# EasyEDA Pro project ProPrj_buck-boost_2026-01-25.epro

# Schematic Schematic1
Create Date: 2025-06-20; Page Name: P1; Project Name: 双向Buck-Boost; Schematic Name: Schematic1; Update Date: 2025-06-20; Company: 嘉立创EDA; Page Size: A4; Version: V1.0
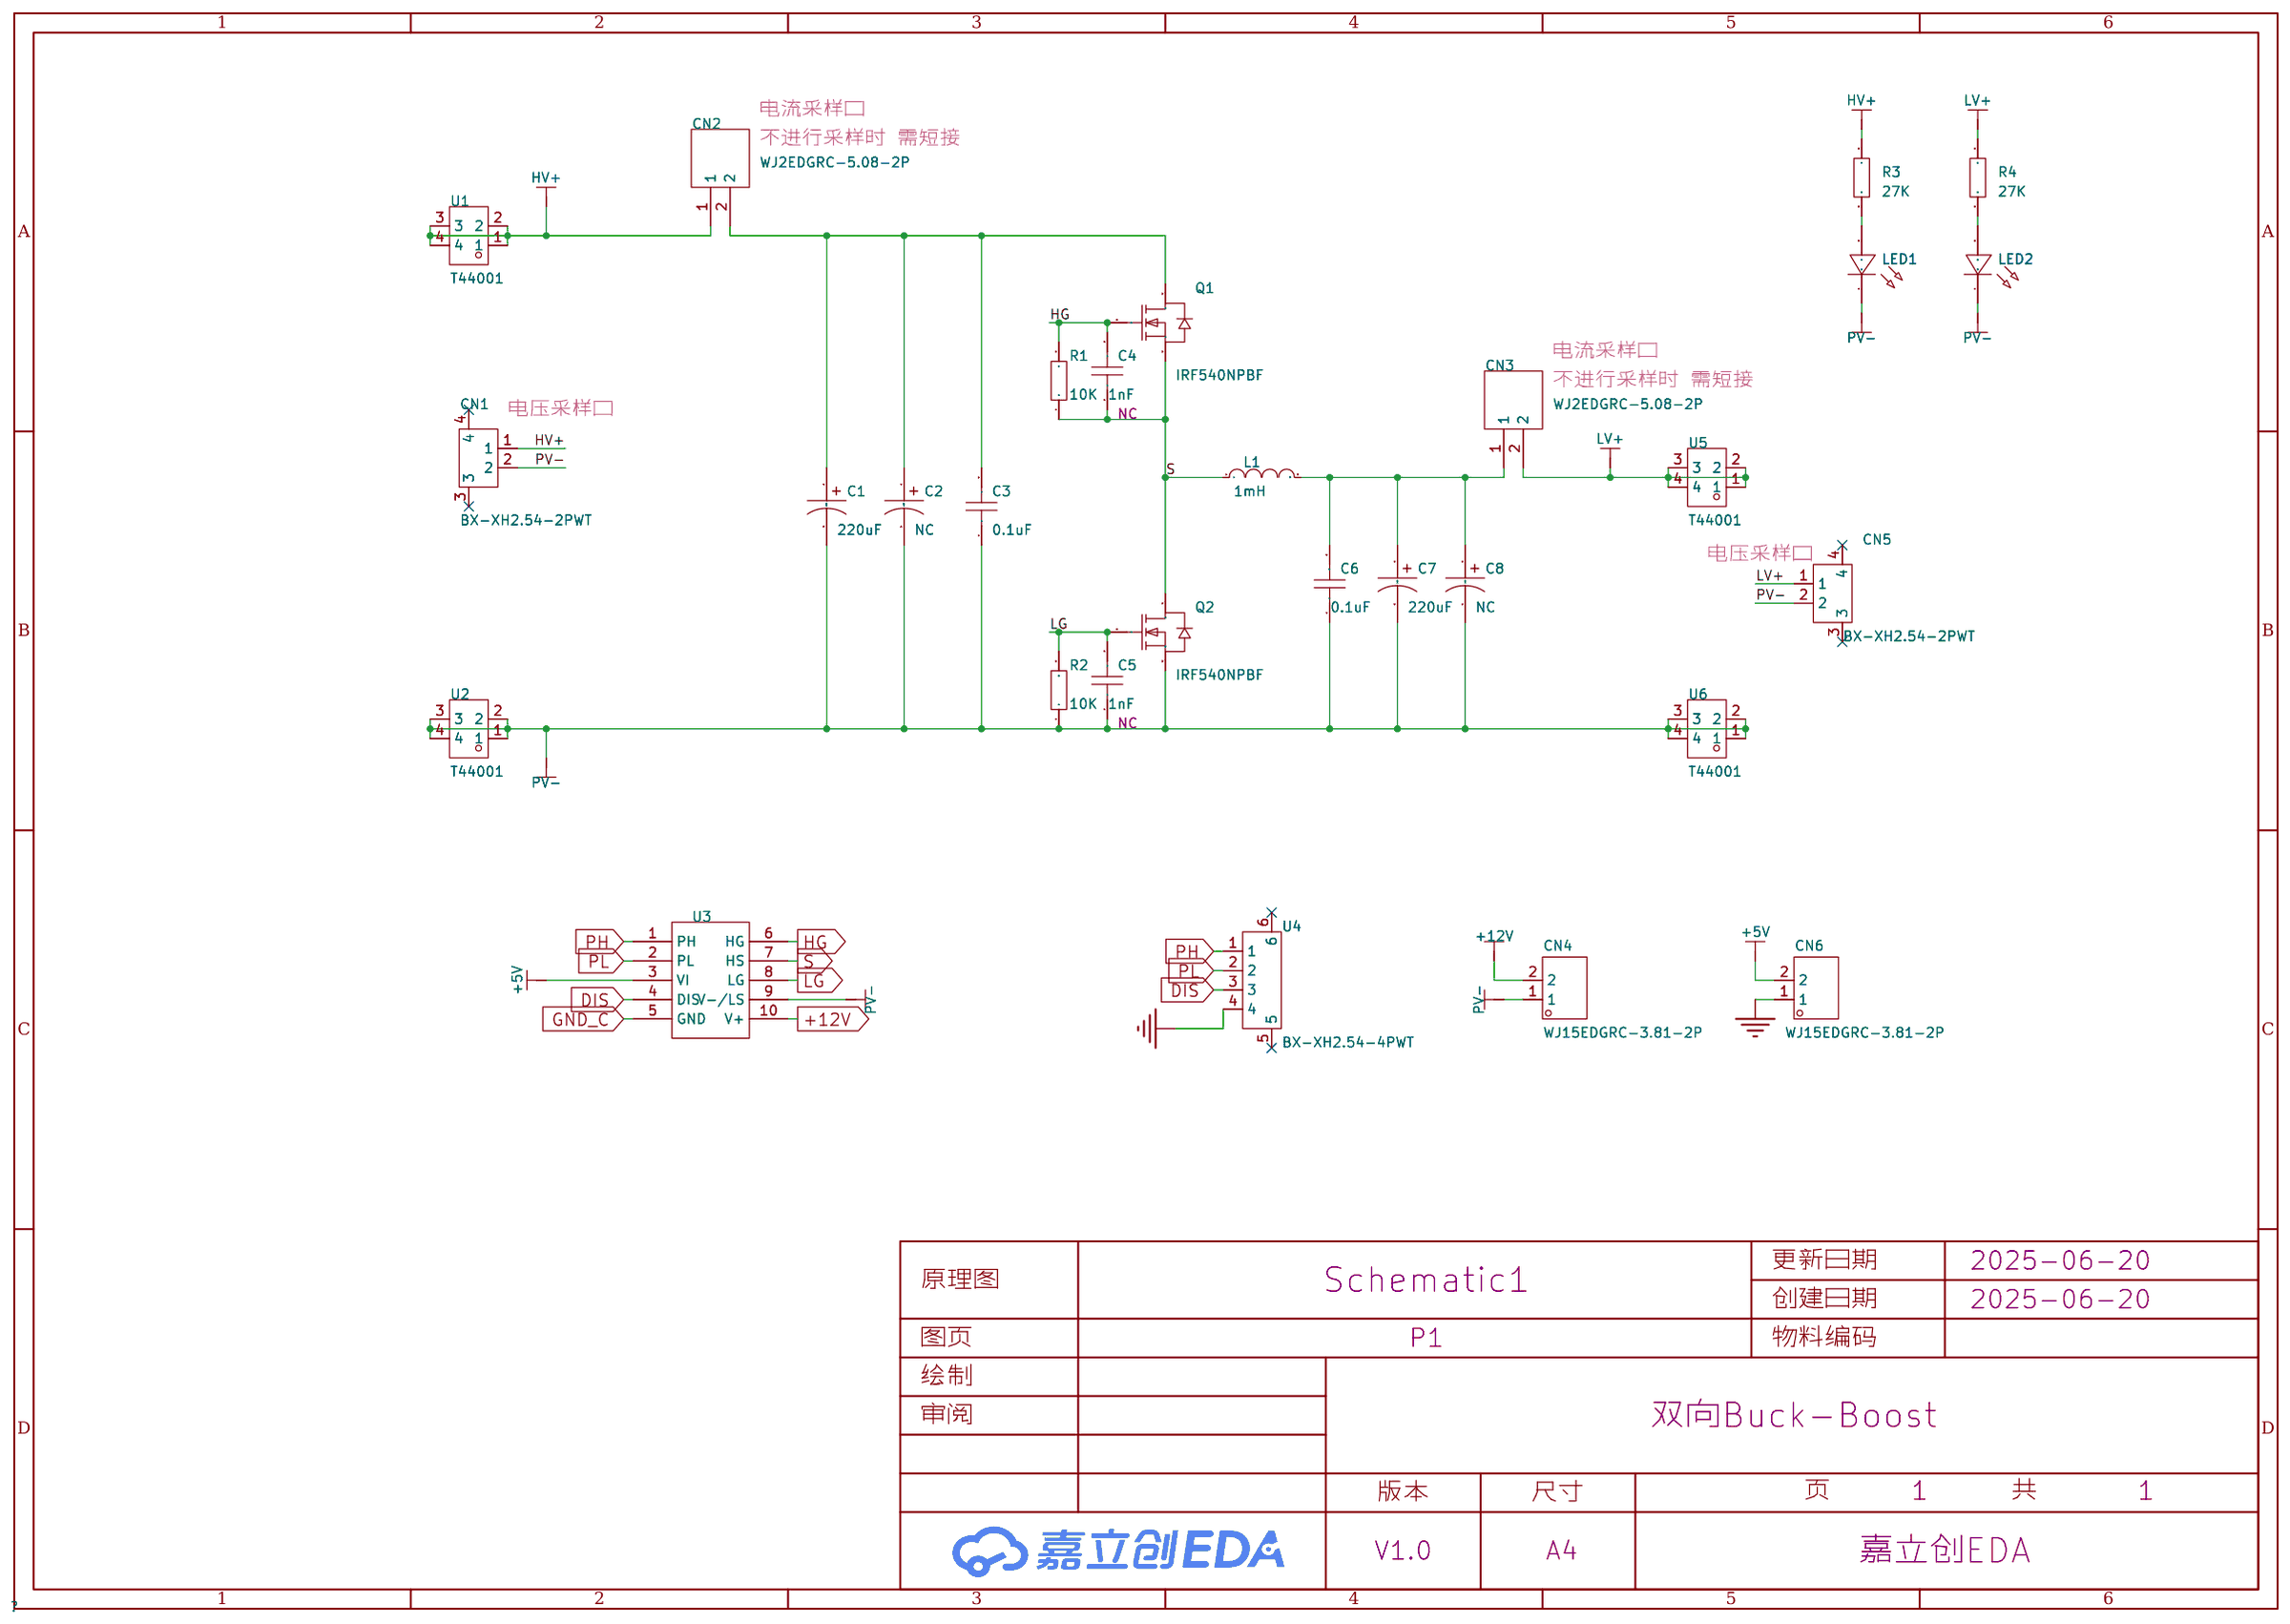
[diagram p0: schematic sheet]

## Parts
C1  220uF  [CAP-TH_BD13.0-P5.00-D0.6-FD]
C2  NC  [CAP-TH_BD13.0-P5.00-D0.6-FD]
C3  0.1uF  [CAP-TH_L9.5-W5.2-P7.50-D0.5]
C4  1nF  [C0805]
C5  1nF  [C0805]
C6  0.1uF  [CAP-TH_L9.5-W5.2-P7.50-D0.5]
C7  220uF  [CAP-TH_BD13.0-P5.00-D0.6-FD]
C8  NC  [CAP-TH_BD13.0-P5.00-D0.6-FD]
CN1  BX-XH2.54-2PWT  [CONN-SMD_2P-P2.50_BX-XH2.54-2PWT]
CN2  WJ2EDGRC-5.08-2P  [CONN-TH_2P-P5.08_WJ2EDGRC-5.08-2P]
CN3  WJ2EDGRC-5.08-2P  [CONN-TH_2P-P5.08_WJ2EDGRC-5.08-2P]
CN4  WJ15EDGRC-3.81-2P  [CONN-TH_2P-P3.81_WJ15EDGRC-3.81-2P]
CN5  BX-XH2.54-2PWT  [CONN-SMD_2P-P2.50_BX-XH2.54-2PWT]
CN6  WJ15EDGRC-3.81-2P  [CONN-TH_2P-P3.81_WJ15EDGRC-3.81-2P]
L1  1mH  [直插环形电感]
LED1  -  [LED_0805]
LED2  -  [LED_0805]
Q1  IRF540NPBF  [TO-220-3_L10.0-W4.5-P2.54-L]
Q2  IRF540NPBF  [TO-220-3_L10.0-W4.5-P2.54-L]
R1  10K  [R1206]
R2  10K  [R1206]
R3  27K  [R0805]
R4  27K  [R0805]
U1  T44001  [CONN-TH_T44001]
U2  T44001  [CONN-TH_T44001]
U3  -  [UCC21520模块]
U4  BX-XH2.54-4PWT  [CONN-SMD_4P-P2.50_BX-XH2.54-4PWT]
U5  T44001  [CONN-TH_T44001]
U6  T44001  [CONN-TH_T44001]

## Library data of the parts
C1 C2 C7 C8 = 100V220uF CD288: 容值:220uF;精度:±20%;额定电压:100V;; LCSC Part Name: 220uF ±20% 100V; Supplier Part: C2960299; Manufacturer: HRK(鸿瑞凯电子); Supplier Footprint: 插件,D13xL21mm; JLCPCB Part Class: 扩展库; Datasheet: https://atta.szlcsc.com/upload/public/pdf/source/20220224/CE0F87E80610B021CAB050353FCD10DD.pdf; Supplier: LCSC; Tolerance: ±20%; Rated Voltage: 100V; Lead Spacing: 5mm; φD: 13mm; L: 21mm; Operating Temperature: -40℃~+105℃
C3 C6 = MPE105J100V82CL0042: 容值:1uF;精度:±5%;额定电压:100V;介电材料:金属化聚酯;工作温度:-55℃~+85℃;; LCSC Part Name: 1uF ±5% 100V; Supplier Part: C2831916; Manufacturer: KNSCHA(科尼盛); Supplier Footprint: 插件,P=7.5mm; JLCPCB Part Class: 扩展库; Datasheet: https://atta.szlcsc.com/upload/public/pdf/source/20210511/C2831916_852CE714E40B423CBF62AC450A564989.pdf; Supplier: LCSC; Tolerance: ±5%; Voltage Rating: 100V; Dielectric Material: 金属化聚酯; Operating Temperature: -55℃~+85℃
C4 C5 = CAP_0805: NC; Supplier Footprint: 0805
CN1 CN5 = BX-XH2.54-2PWT: 插针结构:1x2P;间距:2.5mm;安装方式:卧贴;参考系列:XH;总PIN数:2P;排数:1;每排PIN数:2;行距:-;额定电流:3A;触头材质:黄铜;触头镀层:锡;工作温度:-25℃~+85℃;; LCSC Part Name: 1x2P 间距:2.5mm 卧贴 系列:XH; Supplier Part: C18077872; Manufacturer: Bossie(博锡); Supplier Footprint: SMD,P=2.54mm,卧贴; JLCPCB Part Class: 扩展库; Datasheet: https://atta.szlcsc.com/upload/public/pdf/source/20231017/0FE01907BB7D7B9158C9C040EE6E1091.pdf; Supplier: LCSC; Pins Structure: 1x2P; Pitch: 2.5mm; Mounting Type: 卧贴; Reference Series: XH; Number of Pins: 2P; Number of Rows: 1; Number of PINs Per Row: 2; Current Rating: 3A; Contact Material: 黄铜; Contact Plating: 锡; Operating Temperature: -25℃~+85℃; Voltage Rating: 250V; Plastic Material: LCP; Supplementary Features: 辅助焊脚; Color: 米色; Z-Height of the Board: 6.2mm; X-Length of Bottom Edge on Board (Spacing Line): 10mm; Y-Width of Bottom Edge on Board: 10.5mm
CN2 CN3 = WJ2EDGRC-5.08-2P: 连接器类型:板端/插座-闭口;固定方式:-;结构:1x2P;间距:5.08mm;颜色:绿色;安装方式:弯针;排数:1;每排PIN数:2;额定电流:20A;额定电压:450V;线规 - AWG:-;线规 - 平方毫米:-;触头材质:黄铜;触头镀层:锡;工作温度范围:-40℃~+105℃;焊接温度(最大值):-;; LCSC Part Name: 1x2P 5.08mm 排数:1 每排P数:2; Supplier Part: C3697; Manufacturer: KANGNEX(康奈克斯电气); Supplier Footprint: 弯插,P=5.08mm; JLCPCB Part Class: 扩展库; Datasheet: https://atta.szlcsc.com/upload/public/pdf/source/20240813/4D8AF133EBD88DD18E5AA0CE5EC77AA3.pdf; Supplier: LCSC; Connector Type: 板端/插座-闭口; Structure: 1x2P; Pitch: 5.08mm; Color: 绿色; Mounting Style: 弯针; Number of Pins: 2P; Number of Rows: 1; Number of PINs Per Row: 2; Current Rating (Max): 20A; Voltage Rating (Max): 450V; Contact Material: 黄铜; Contact Plating: 锡; Operating Temperature Range: -40℃~+105℃
CN4 CN6 = WJ15EDGRC-3.81-2P: 连接器类型:板端/插座-闭口;固定方式:-;结构:1x2P;间距:3.81mm;颜色:-;安装方式:弯针;排数:1;每排PIN数:2;额定电流:8A;额定电压:300V;线规 - AWG:-;线规 - 平方毫米:-;触头材质:黄铜;触头镀层:锡;工作温度范围:-40℃~+105℃;焊接温度(最大值):-;; LCSC Part Name: 1x2P 3.81mm 排数:1 每排P数:2; Supplier Part: C8387; Manufacturer: KANGNEX(康奈克斯电气); Supplier Footprint: 弯插,P=3.81mm; JLCPCB Part Class: 扩展库; Datasheet: https://atta.szlcsc.com/upload/public/pdf/source/20191225/C8387_8EBAF10345D2762F0167C8753398EEFA.pdf; Supplier: LCSC; Connector Type: 板端/插座-闭口; Structure: 1x2P; Pitch: 3.81mm; Mounting Style: 弯针; Number of Pins: 2P; Number of Rows: 1; Number of PINs Per Row: 2; Current Rating (Max): 8A; Voltage Rating (Max): 300V; Contact Material: 黄铜; Contact Plating: 锡; Operating Temperature Range: -40℃~+105℃
L1 = 直插环形电感
LED1 LED2 = LED_0805-G: Supplier Footprint: 0805
Q1 Q2 = IRF540NPBF: 类型:1个N沟道;漏源电压(Vdss):100V;连续漏极电流(Id):33A;导通电阻(RDS(on)@Vgs,Id):44mΩ@10V,16A;功率(Pd):130W;阈值电压(Vgs(th)@Id):4V@250uA;; LCSC Part Name: 1个N沟道 耐压:100V 电流:33A; Supplier Part: C2566; Manufacturer: Infineon(英飞凌); Supplier Footprint: TO-220AB; JLCPCB Part Class: 扩展库; Datasheet: https://atta.szlcsc.com/upload/public/pdf/source/20140818/1457707225950.pdf; Supplier: LCSC; Type: 1个N沟道; Drain Source Voltage (Vdss): 100V; Continuous Drain Current (Id): 33A; Drain Source On Resistance (RDS(on)@Vgs,Id): 44mΩ@10V,16A; Power Dissipation (Pd): 130W; Gate Threshold Voltage (Vgs(th)@Id): 4V@250uA; Total Gate Charge (Qg@Vgs): 71nC; Input Capacitance (Ciss@Vds): 1.96nF; Reverse Transfer Capacitance (Crss@Vds): 40pF; Operating Temperature: -55℃~+175℃
R1 R2 = Res_1206: Supplier Footprint: 1206
R3 R4 = Res_0805: Supplier Footprint: 0805
U1 U2 U5 U6 = T44001: LCSC Part Name: 四脚 M4 二件套; Supplier Part: C481447; Manufacturer: XFCN(兴飞); Supplier Footprint: 插件; JLCPCB Part Class: Extended Part; Datasheet: https://atta.szlcsc.com/upload/public/pdf/source/20200107/C481447_E931C3E48018A580005A301DF9398631.pdf; Supplier: LCSC
U3 = UCC21520驱动模块
U4 = BX-XH2.54-4PWT: 插针结构:1x4P;间距:2.5mm;安装方式:卧贴;参考系列:XH;总PIN数:4P;排数:1;每排PIN数:4;行距:-;额定电流:3A;触头材质:黄铜;触头镀层:锡;工作温度:-25℃~+85℃;; LCSC Part Name: 1x4P 间距:2.5mm 卧贴 系列:XH; Supplier Part: C18077874; Manufacturer: Bossie(博锡); Supplier Footprint: SMD,P=2.54mm,卧贴; JLCPCB Part Class: 扩展库; Datasheet: https://atta.szlcsc.com/upload/public/pdf/source/20231017/0190CFE07212E1CAC18B68BF0ACD8A1F.pdf; Supplier: LCSC; Pins Structure: 1x4P; Pitch: 2.5mm; Mounting Type: 卧贴; Reference Series: XH; Number of Pins: 4P; Number of Rows: 1; Number of PINs Per Row: 4; Current Rating: 3A; Contact Material: 黄铜; Contact Plating: 锡; Operating Temperature: -25℃~+85℃; Voltage Rating: 250V; Plastic Material: LCP; Supplementary Features: 辅助焊脚; Color: 米色; Z-Height of the Board: 6.2mm; X-Length of Bottom Edge on Board (Spacing Line): 15mm; Y-Width of Bottom Edge on Board: 10.5mm

## Nets
+5V: CN6.2 U3.3(VI)
+12V: CN4.2 U3.10(V+)
GND_C: CN6.1 U3.5(GND) U4.4
DIS: U3.4(DIS) U4.3
HG: C4.2 Q1.1(G) R1.2 U3.6(HG)
HV+: CN1.1 CN2.1 R3.1 U1.1 U1.2 U1.3 U1.4
LG: C5.2 Q2.1(G) R2.2 U3.8(LG)
LV+: CN3.2 CN5.1 R4.1 U5.1 U5.2 U5.3 U5.4
PH: U3.1(PH) U4.1
PL: U3.2(PL) U4.2
PV-: C1.2 C2.2 C3.1 C5.1 C6.1 C7.2 C8.2 CN1.2 CN4.1 CN5.2 LED1.1(C) LED2.1(C) Q2.3(S) R2.1 U2.1 U2.2 U2.3 U2.4 U3.9(V-/LS) U6.1 U6.2 U6.3 U6.4
S: C4.1 L1.1 Q1.3(S) Q2.2(D) R1.1 U3.7(HS)
Net-(C1-1): C1.1 C2.1 C3.2 CN2.2 Q1.2(D)
Net-(C6-2): C6.2 C7.1 C8.1 CN3.1 L1.2
Net-(LED1-2): LED1.2(A) R3.2
Net-(LED2-2): LED2.2(A) R4.2

Not connected (* = marked no-connect by the designer): CN1 3* 4*; CN5 3* 4*; U4 5* 6*

## Notes on the sheet
- 电流采样口
- 不进行采样时 需短接
- 电流采样口
- 不进行采样时 需短接
- 电压采样口
- 电压采样口

# Schematic 单buck/boost
Board Name: PCB3; Create Date: 2025-07-15; Page Name: P1; Project Name: buck-boost; Schematic Name: 单buck/boost; Update Date: 2025-07-22; Company: 嘉立创EDA; Page Size: A4; Version: V1.0
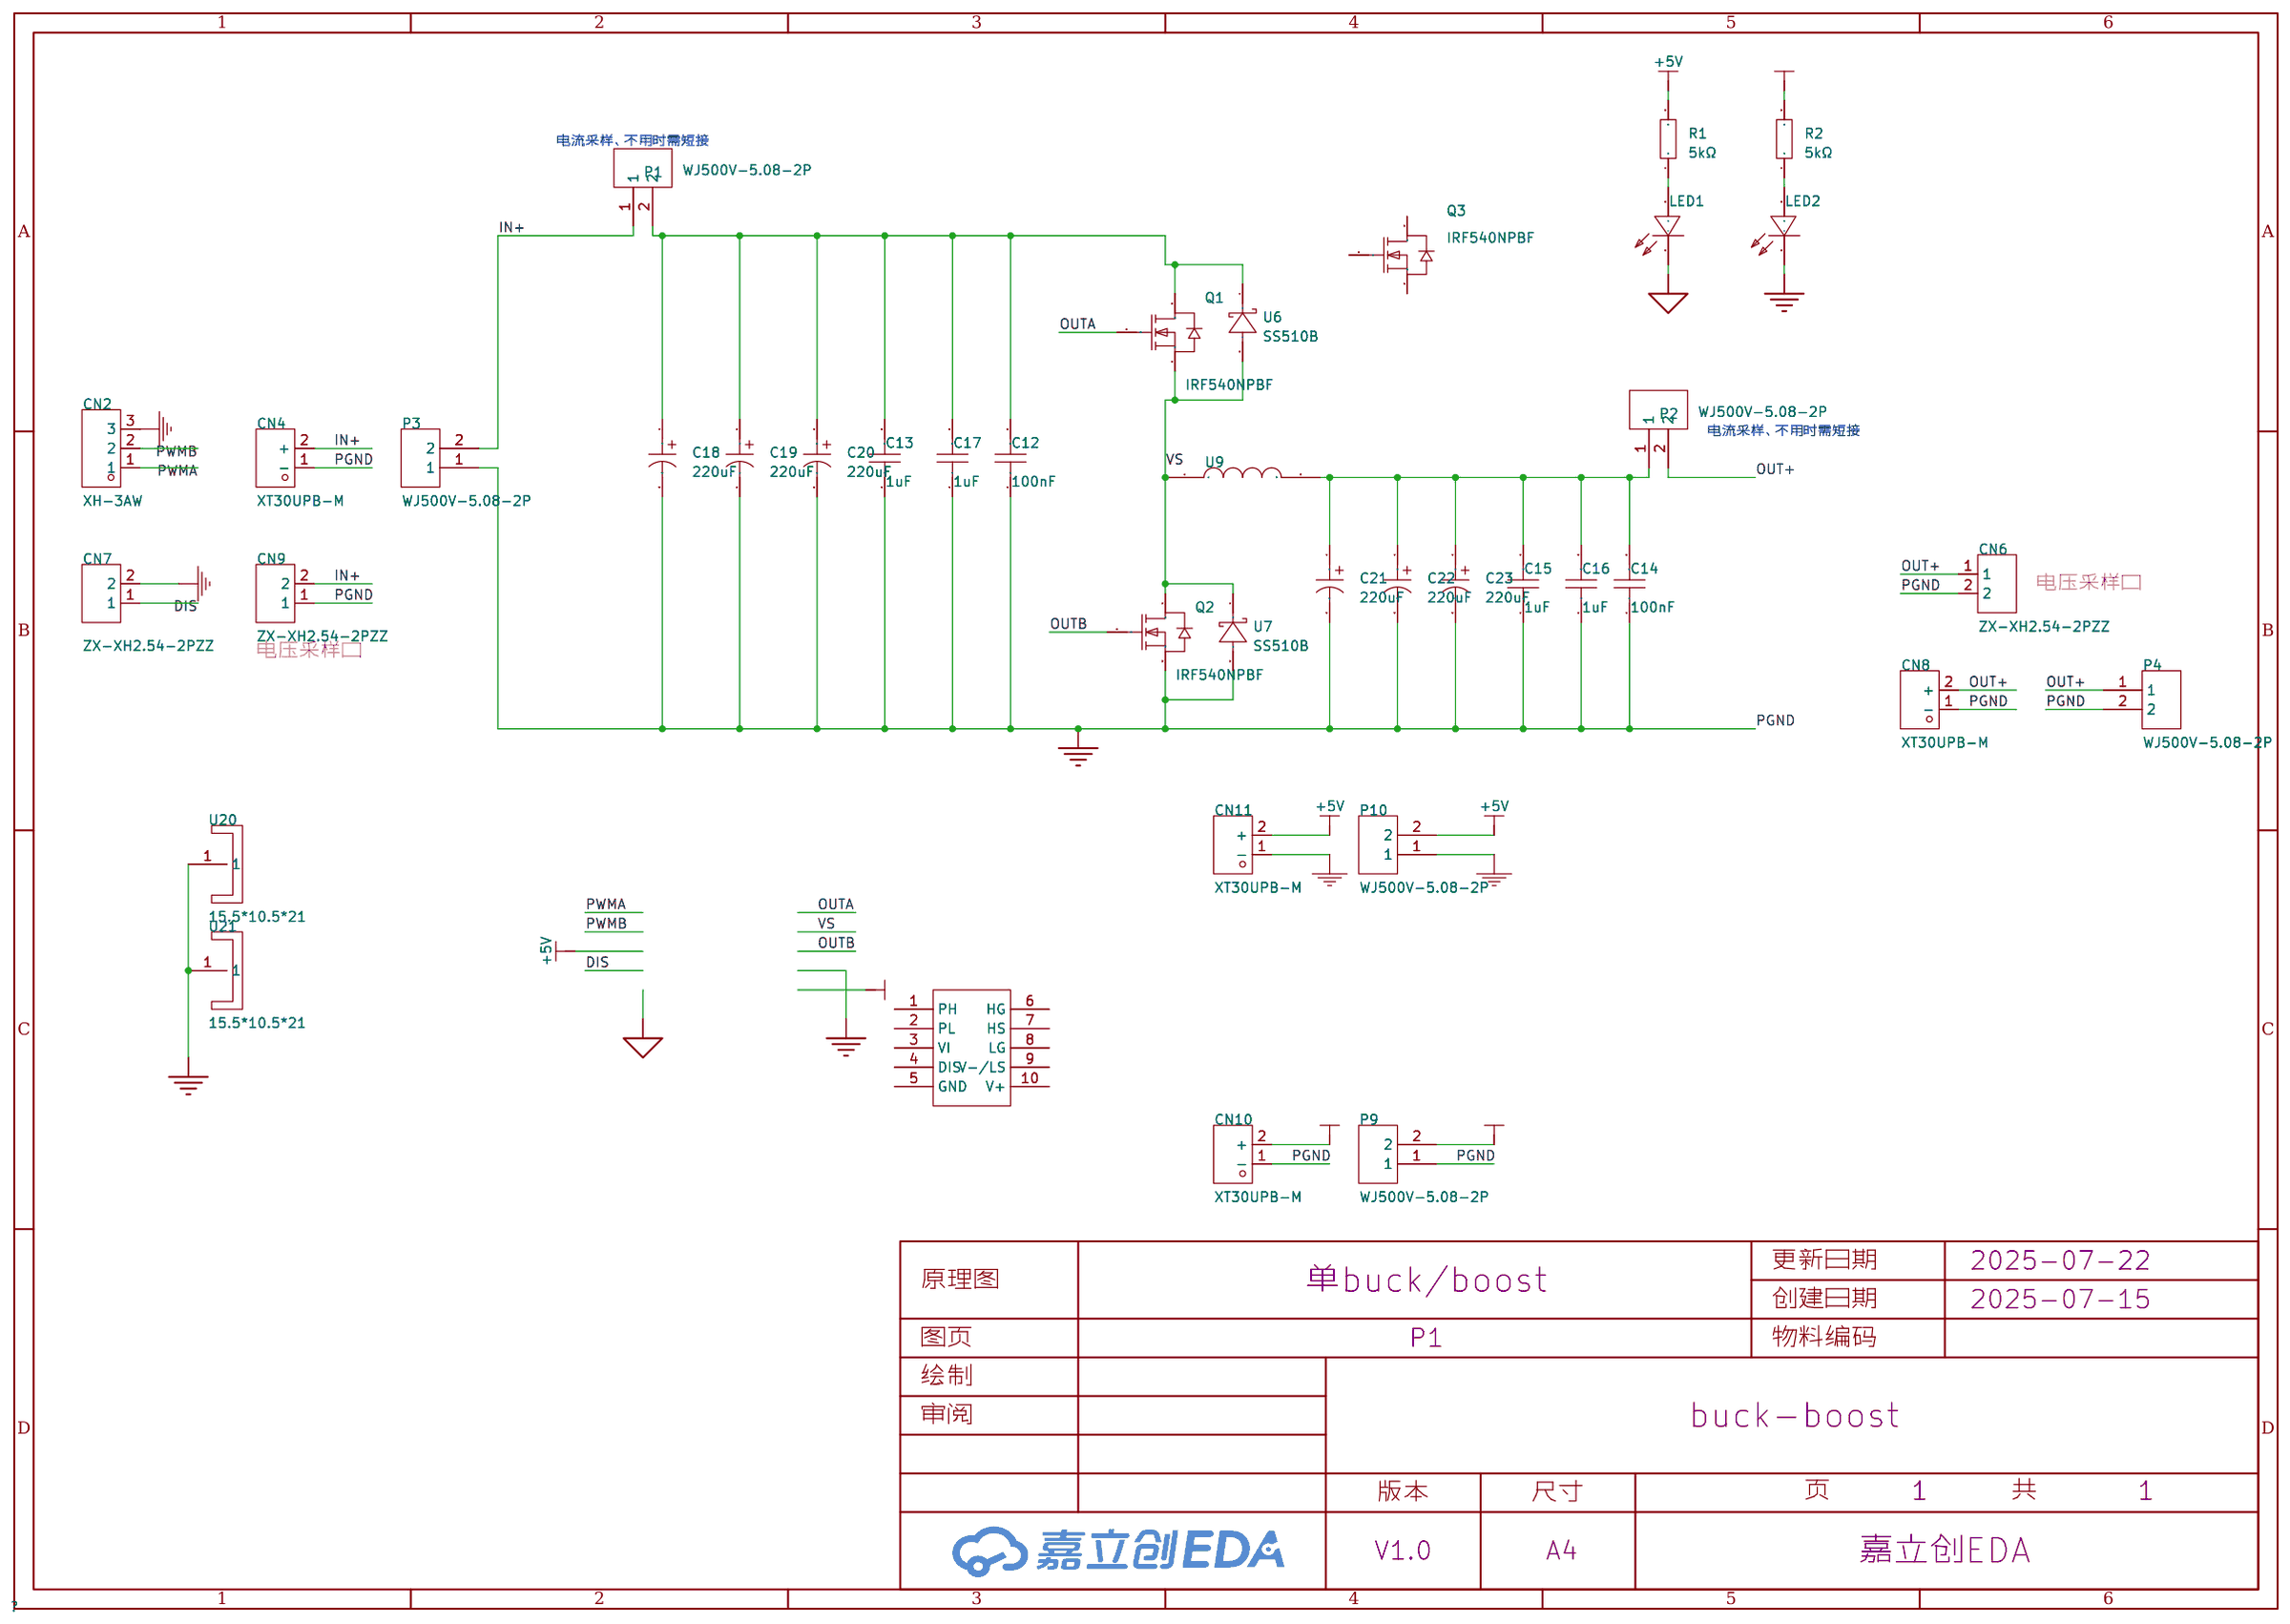
[diagram p1: schematic sheet]

## Parts
C12  100nF  [C0603]
C13  1uF  [C0603]
C14  100nF  [C0603]
C15  1uF  [C0603]
C16  1uF  [C0603]
C17  1uF  [C0603]
C18  220uF  [CAP-TH_BD10.0-P5.00-D0.6-FD_2]
C19  220uF  [CAP-TH_BD10.0-P5.00-D0.6-FD_2]
C20  220uF  [CAP-TH_BD10.0-P5.00-D0.6-FD_2]
C21  220uF  [CAP-TH_BD10.0-P5.00-D0.6-FD_2]
C22  220uF  [CAP-TH_BD10.0-P5.00-D0.6-FD_2]
C23  220uF  [CAP-TH_BD10.0-P5.00-D0.6-FD_2]
CN2  XH-3AW  [CONN-TH_3P-P2.54_HCTL_XH-3AW]
CN4  XT30UPB-M  [CONN-TH_XT30UPB-M]
CN6  ZX-XH2.54-2PZZ  [CONN-TH_2P-P2.50_HX25003-2A]
CN7  ZX-XH2.54-2PZZ  [CONN-TH_2P-P2.50_HX25003-2A]
CN8  XT30UPB-M  [CONN-TH_XT30UPB-M]
CN9  ZX-XH2.54-2PZZ  [CONN-TH_2P-P2.50_HX25003-2A]
CN10  XT30UPB-M  [CONN-TH_XT30UPB-M]
CN11  XT30UPB-M  [CONN-TH_XT30UPB-M]
LED1  LTST-C190KSKT  [LED0603-RD]
LED2  LTST-C190KSKT  [LED0603-RD]
P1  WJ500V-5.08-2P  [CONN-TH_2P-P5.00_WJ500V-5.08-2P]
P2  WJ500V-5.08-2P  [CONN-TH_2P-P5.00_WJ500V-5.08-2P]
P3  WJ500V-5.08-2P  [CONN-TH_2P-P5.00_WJ500V-5.08-2P]
P4  WJ500V-5.08-2P  [CONN-TH_2P-P5.00_WJ500V-5.08-2P]
P9  WJ500V-5.08-2P  [CONN-TH_2P-P5.00_WJ500V-5.08-2P]
P10  WJ500V-5.08-2P  [CONN-TH_2P-P5.00_WJ500V-5.08-2P]
Q1  IRF540NPBF  [TO-220-3_L10.0-W4.5-P2.54-L]
Q2  IRF540NPBF  [TO-220-3_L10.0-W4.5-P2.54-L]
Q3  IRF540NPBF  [TO-220-3_L10.0-W4.5-P2.54-L]
R1  5kΩ  [R0603]
R2  5kΩ  [R0603]
U1  -  [UCC21520模块]
U6  SS510B  [SMB_L4.6-W3.5-LS5.3-RD]
U7  SS510B  [SMB_L4.6-W3.5-LS5.3-RD]
U9  -  [L_P14MM]
U20  15.5*10.5*21  [SINK-TH_L15.0-W10.5-H21.0]
U21  15.5*10.5*21  [SINK-TH_L15.0-W10.5-H21.0]

## Library data of the parts
C12 C14 = CGA0603X7R104K500JT: 容值:100nF;精度:±10%;额定电压:50V;温度系数:X7R;; LCSC Part Name: 100nF ±10% 50V; Supplier Part: C6119867; Manufacturer: HRE(芯声); Supplier Footprint: 0603; JLCPCB Part Class: 扩展库; Datasheet: https://atta.szlcsc.com/upload/public/pdf/source/20250103/C44077DA9E7B3EFAE02F22B6D3D1CBC9.pdf; Supplier: LCSC; Tolerance: ±10%; Voltage Rating: 50V; Temperature Coefficient: X7R
C13 C15-C17 = CC0603KRX7R9BB105: 容值:1uF;精度:±10%;额定电压:50V;材质(温度系数):X7R;; LCSC Part Name: 1uF ±10% 50V; Supplier Part: C559769; Manufacturer: YAGEO(国巨); Supplier Footprint: 0603; JLCPCB Part Class: 扩展库; Datasheet: https://atta.szlcsc.com/upload/public/pdf/source/20181031/C325451_C7CF01155AE3010E0D610C52F5FE7D31.pdf; Supplier: LCSC; Tolerance: ±10%; Voltage Rated: 50V; Temperature Coefficient: X7R
C18-C23 = PA50V220M10x12: 容值:220uF;精度:±20%;额定电压:50V;纹波电流:3.5A@100kHz;等效串联电阻(ESR):20mΩ@100kHz;类型:聚合物;; LCSC Part Name: 220uF ±20% 50V; Supplier Part: C46550451; Manufacturer: 捷而瑞; Supplier Footprint: 插件,D10xL12.5mm; JLCPCB Part Class: 扩展库; Datasheet: https://atta.szlcsc.com/upload/public/pdf/source/20250307/831193F737CAF6D75AC25F14E955F0EC.pdf; Supplier: LCSC; Tolerance: ±20%; Voltage Rating: 50V; Ripple Current: 3.5A@100kHz; Equivalent Series Resistance(ESR): 20mΩ@100kHz; Type: 聚合物; Diameter: 10mm; Height - Seated (Max): 12.5mm; Lifetime: 2000hrs@105℃; Operating Temperature: -55℃~+105℃
CN2 = XH-3AW_C2908612: 插针结构:1x3P;间距:2.54mm;安装方式:弯插;参考系列:XH;总PIN数:3P;排数:1;每排PIN数:3;行距:-;额定电流:3A;触头材质:黄铜;触头镀层:锡;工作温度范围:-25℃~+85℃;; LCSC Part Name: 1x3P 间距:2.54mm 弯插 系列:XH; Supplier Part: C2908612; Manufacturer: HCTL(华灿天禄); Supplier Footprint: 弯插,P=2.5mm; JLCPCB Part Class: 扩展库; Datasheet: https://atta.szlcsc.com/upload/public/pdf/source/20230711/B565BAF3B11666EF6B81B3605408F2BD.pdf; Supplier: LCSC; Pins Structure: 1x3P; Pitch: 2.54mm; Mounting Style: 弯插; Reference Series: XH; Number of Pins: 3P; Number of Rows: 1; Number of PINs Per Row: 3; Current Rating (Max): 3A; Contact Material: 黄铜; Contact Plating: 锡; Operating Temperature Range: -25℃~+85℃
CN4 CN8 CN10 CN11 = XT30UPB-M: 类别:-;类型1:-;; LCSC Part Name: AMASS(艾迈斯)板载立式 航模锂电池控制器连接器插头 公头XT30UPB-M; Supplier Part: C428721; Manufacturer: AMASS(艾迈斯); JLCPCB Part Class: 扩展库; Datasheet: https://atta.szlcsc.com/upload/public/pdf/source/20230412/7B5DFEF57C9EA5273853390C734B3AC5.pdf; Supplier: LCSC; Type: 航模插头; Colour: 黄色; RatedVoltage: DC 500V; InterfaceType: 公头; MetalMaterial: 镀金; InsulationMaterial: PA; RatedCurrent: 15A; contact resistance: 0.65mΩ
CN6 CN7 CN9 = ZX-XH2.54-2PZZ: 插针结构:1x2P;间距:2.5mm;安装方式:直插;参考系列:XH;总PIN数:2P;排数:1;每排PIN数:2;行距:-;额定电流:3A;触头材质:黄铜;触头镀层:锡;工作温度:-25℃~+85℃;; LCSC Part Name: 1x2P 间距:2.5mm 直插 系列:XH; Supplier Part: C7429632; Manufacturer: Megastar(兆星); Supplier Footprint: 插件,P=2.5mm; JLCPCB Part Class: 扩展库; Datasheet: https://atta.szlcsc.com/upload/public/pdf/source/20230619/19BA6947230AA44A04D3EDD65E618FD0.pdf; Supplier: LCSC; Pins Structure: 1x2P; Pitch: 2.5mm; Mounting Type: 直插; Reference Series: XH; Number of Pins: 2P; Number of Rows: 1; Number of PINs Per Row: 2; Current Rating: 3A; Contact Material: 黄铜; Contact Plating: 锡; Operating Temperature: -25℃~+85℃; Voltage Rating: 250V; Plastic Material: PA66; Flame Retardant Rating: UL94V-0; Color: 白色; Z-Height of the Board: 7mm; X-Length of Bottom Edge on Board (Spacing Line): 7.5mm; Y-Width of Bottom Edge on Board: 5.9mm
LED1 LED2 = LTST-C190KSKT: 发光颜色:黄色;正向电压(VF):2.1V;功率:75mW;正向电流:20mA;主波长:584.5nm~597nm;二极管配置:-;透镜颜色:无色透明透镜;色温:-;发光强度:104mcd;发光角度:130°;载带方式:-;工作温度:-30℃~+85℃;; LCSC Part Name: 黄灯; Supplier Part: C125095; Manufacturer: LITEON(光宝); Supplier Footprint: 0603; JLCPCB Part Class: 扩展库; Datasheet: https://atta.szlcsc.com/upload/public/pdf/source/20180129/C125095_15171881843821315881.pdf; Supplier: LCSC; Emitted Color: 黄色; Forward Voltage (VF): 2.1V; Power Dissipation: 75mW; Forward Current: 20mA; Dominant Wavelength: 584.5nm~597nm; Peak Wavelength: 588nm; Lens Color: 无色透明透镜; Luminous Intensity: 104mcd; Viewing Angle: 130°; Operating Temperature: -30℃~+85℃
P1-P4 P9 P10 = WJ500V-5.08-2P: 结构:1x2P;间距:5.08mm;颜色:绿色;安装方式:直插;额定电流:18A;额定电压:250V;排数:1;线规 - AWG:14~30;线规 - 平方毫米:2.5;每排PIN数:2;触头材质:-;触头镀层:-;工作温度范围:-40℃~+105℃;焊接温度(最大值):-;; LCSC Part Name: 1x2P 5.08mm 直插 排数:1 每排P数:2; Supplier Part: C8465; Manufacturer: KANGNEX(康奈克斯电气); Supplier Footprint: 插件,P=5.08mm; JLCPCB Part Class: 扩展库; Datasheet: https://atta.szlcsc.com/upload/public/pdf/source/20191225/C8465_02D34CE5B5B4A53DF5891601D97FA9F4.pdf; Supplier: LCSC; Structure: 1x2P; Pitch: 5.08mm; Color: 绿色; Mounting Style: 直插; Current Rating (Max): 18A; Voltage Rating (Max): 250V; Number of Pins: 2P; Number of Rows: 1; Wire Gauge - AWG: 14~30; Wire Gauge - mm2: 2.5; Number of PINs Per Row: 2; Operating Temperature Range: -40℃~+105℃; Screw Specification: M2.5
Q1-Q3 = IRF540NPBF: 类型:1个N沟道;漏源电压(Vdss):100V;连续漏极电流(Id):33A;导通电阻(RDS(on)@Vgs,Id):44mΩ@10V,16A;功率(Pd):130W;阈值电压(Vgs(th)@Id):4V@250uA;; LCSC Part Name: 1个N沟道 耐压:100V 电流:33A; Supplier Part: C2566; Manufacturer: Infineon(英飞凌); Supplier Footprint: TO-220AB; JLCPCB Part Class: 扩展库; Datasheet: https://atta.szlcsc.com/upload/public/pdf/source/20140818/1457707225950.pdf; Supplier: LCSC; Type: 1个N沟道; Drain Source Voltage (Vdss): 100V; Continuous Drain Current (Id): 33A; Drain Source On Resistance (RDS(on)@Vgs,Id): 44mΩ@10V,16A; Power Dissipation (Pd): 130W; Gate Threshold Voltage (Vgs(th)@Id): 4V@250uA; Total Gate Charge (Qg@Vgs): 71nC; Input Capacitance (Ciss@Vds): 1.96nF; Reverse Transfer Capacitance (Crss@Vds): 40pF; Operating Temperature: -55℃~+175℃
R1 R2 = RT0603BRE075KL: 电阻类型:薄膜电阻;阻值:5kΩ;精度:±0.1%;功率:100mW;温度系数:±50ppm/℃;; LCSC Part Name: 薄膜电阻 5kΩ ±0.1% 100mW; Supplier Part: C862232; Manufacturer: YAGEO(国巨); Supplier Footprint: 0603; JLCPCB Part Class: 扩展库; Datasheet: https://atta.szlcsc.com/upload/public/pdf/source/20200610/C326738_5639A9F1B6EB6E4AE2197577D3456E7F.pdf; Supplier: LCSC; Type: 薄膜电阻; Tolerance: ±0.1%; Power(Watts): 100mW; Temperature Coefficient: ±50ppm/℃; Operating Temperature Range: -55℃~+155℃
U1 = UCC21520驱动模块
U6 U7 = SS510B_C7420368: 二极管配置:独立式;正向压降(Vf):850mV@5A;直流反向耐压(Vr):100V;整流电流:5A;; LCSC Part Name: 电压:100V 电流:5A; Supplier Part: C7420368; Manufacturer: 宏迦橙; Supplier Footprint: SMB; JLCPCB Part Class: 扩展库; Datasheet: https://atta.szlcsc.com/upload/public/pdf/source/20230828/ADE8C1045B0A3FBEF0BE74B24027BF5A.pdf; Supplier: LCSC; Diode Configuration: 独立式; Forward Voltage (Vf@If): 850mV@5A; Reverse Voltage (Vr): 100V; Rectified Current: 5A; Reverse Leakage Current (Ir): 50uA@100V
U9 = L_P14MM
U20 U21 = 15.5*10.5*21: 产品尺寸:15.5*10.5*21MM;材 质:6063-T5;; LCSC Part Name: H型散热片; Supplier Part: C4649; Manufacturer: XSD(鑫顺达); JLCPCB Part Class: 扩展库; Datasheet: https://atta.szlcsc.com/upload/public/pdf/source/20171202/C4649_15122106328221160233.pdf; Supplier: LCSC; ProductSize: 15.5*10.5*21MM; Colour: 白色; TextureOfMaterial: 6063-T5; SurfaceTreatment: 本色洗白; Shape: H型; SpringBuckle: -；-；-；-；-；-；-；-

## Nets
+5V: CN11.2(+) P10.2 R1.2
+12V: CN10.2(+) P9.2 R2.2
AGND: CN2.3 CN7.2 CN11.1(-) LED1.1(-) P10.1
PGND: C12.1 C13.1 C14.1 C15.1 C16.1 C17.1 C18.2 C19.2 C20.2 C21.2 C22.2 C23.2 CN4.1(-) CN6.2 CN8.1(-) CN9.1 CN10.1(-) LED2.1(-) P3.1 P4.2 P9.1 Q2.3(S) U7.2(A) U20.1 U21.1
DIS: CN7.1
IN+: CN4.2(+) CN9.2 P1.1 P3.2
OUT+: CN6.1 CN8.2(+) P2.2 P4.1
OUTA: Q1.1(G)
OUTB: Q2.1(G)
PWMA: CN2.1
PWMB: CN2.2
VS: Q1.3(S) Q2.2(D) U6.2(A) U7.1(K) U9.1
$1N2703: LED1.2(+) R1.1
$1N2751: LED2.2(+) R2.1
$1N2815: C12.2 C13.2 C17.2 C18.1 C19.1 C20.1 P1.2 Q1.2(D) U6.1(K)
$1N2826: C14.2 C15.2 C16.2 C21.1 C22.1 C23.1 P2.1 U9.2

Not connected (* = marked no-connect by the designer): Q3 1(G) 2(D) 3(S); U1 1(PH) 2(PL) 3(VI) 4(DIS) 5(GND) 6(HG) 7(HS) 8(LG) 9(V-/LS) 10(V+)

## Notes on the sheet
- 电流采样、不用时需短接
- 电流采样、不用时需短接
- 电压采样口
- 电压采样口

# Board PCB3
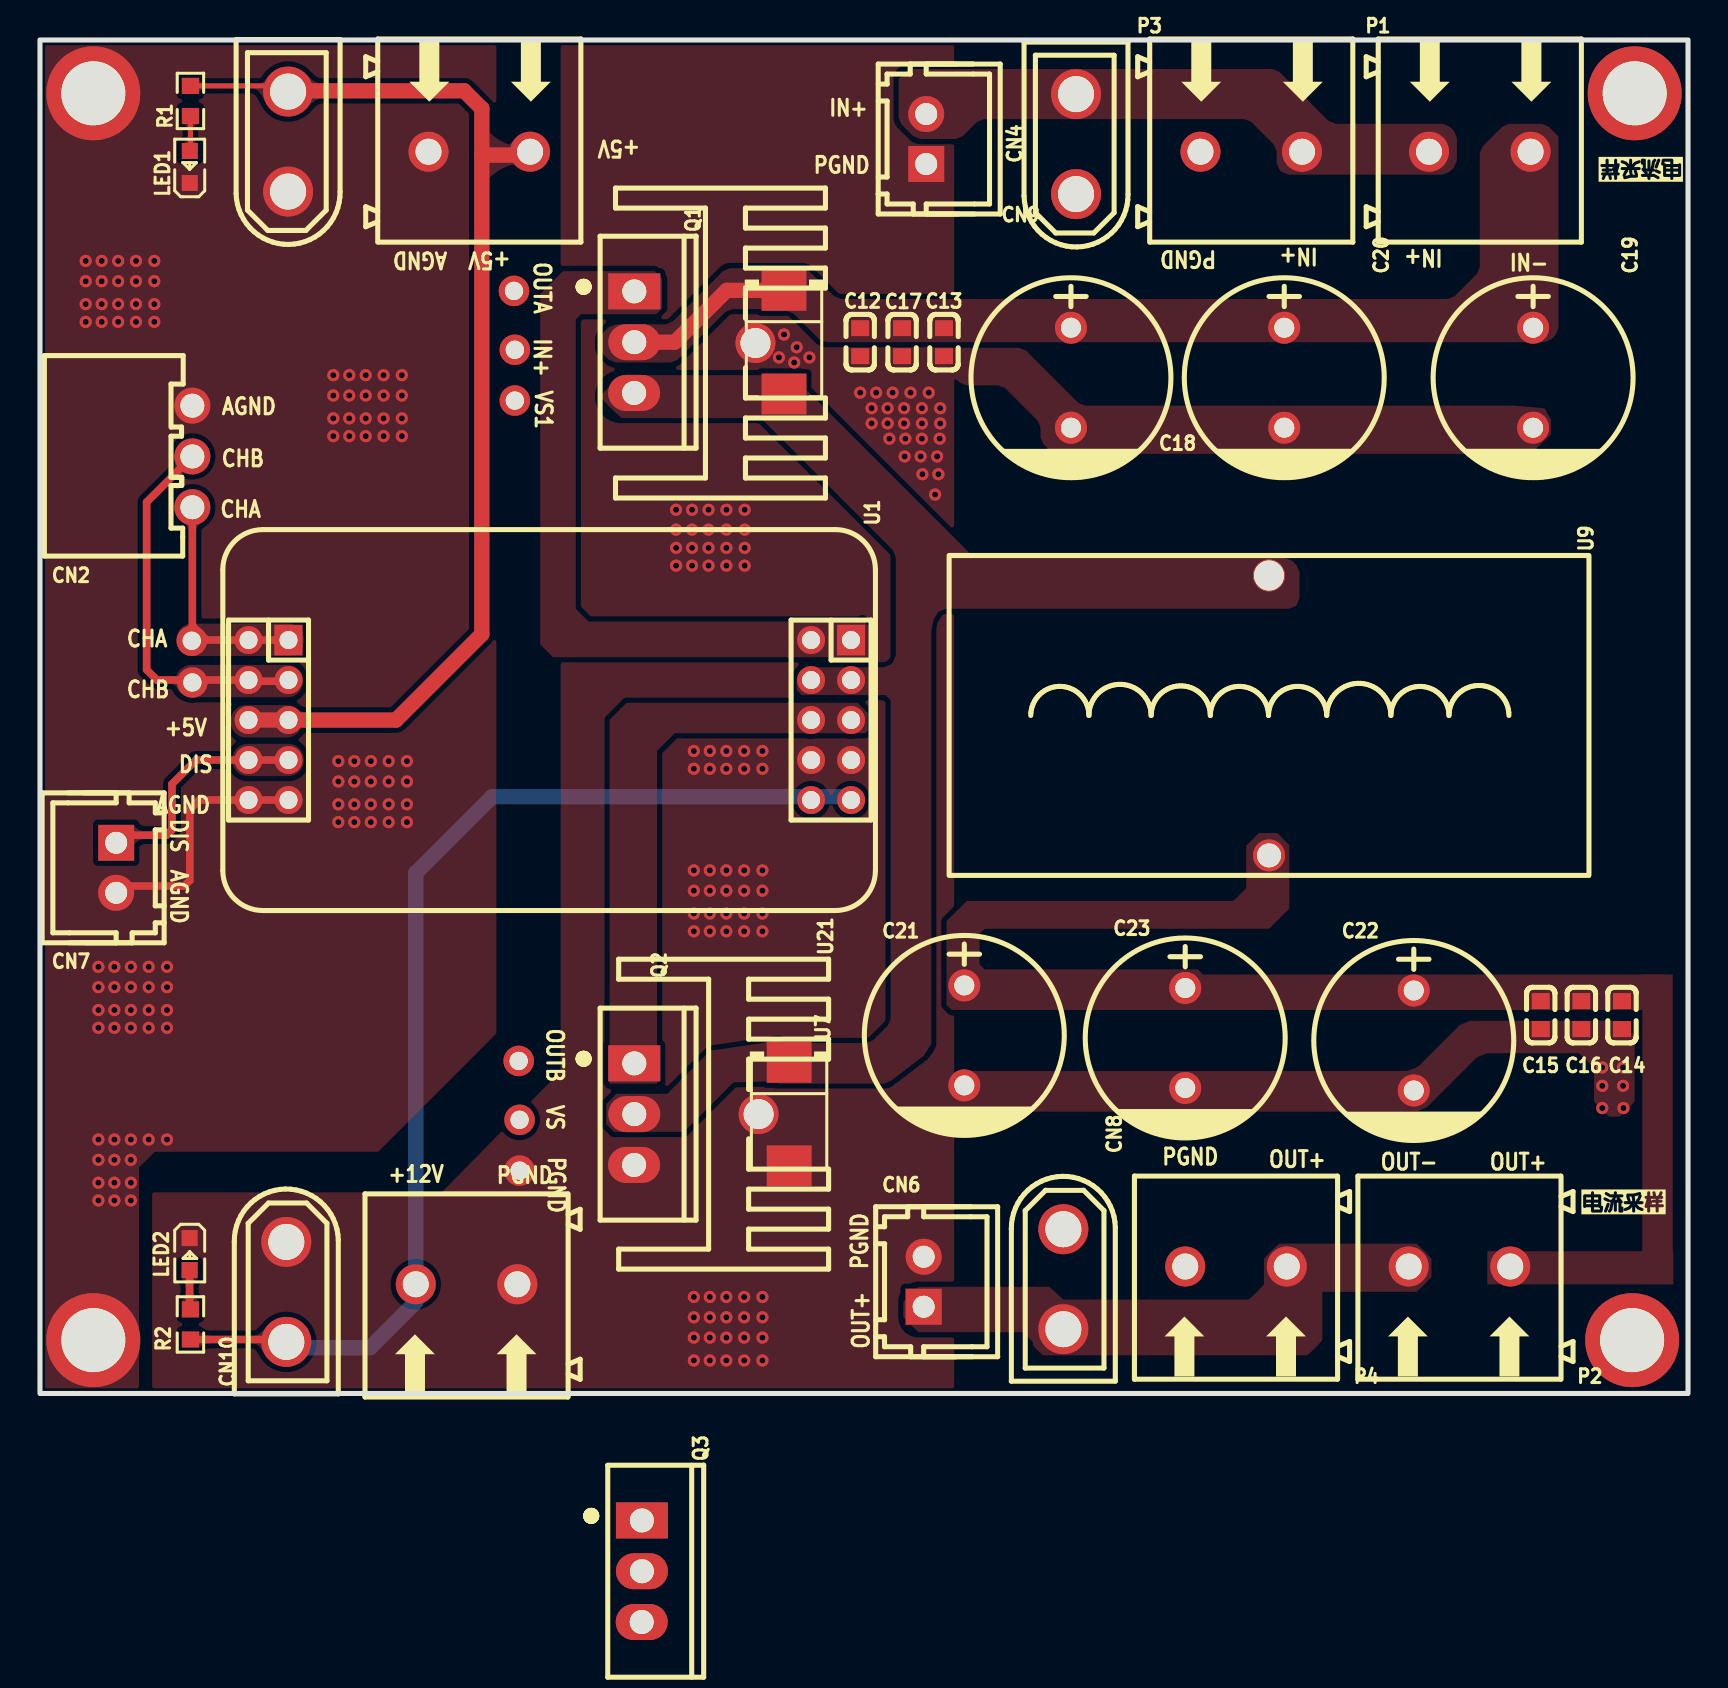
[diagram p2: board, top side]
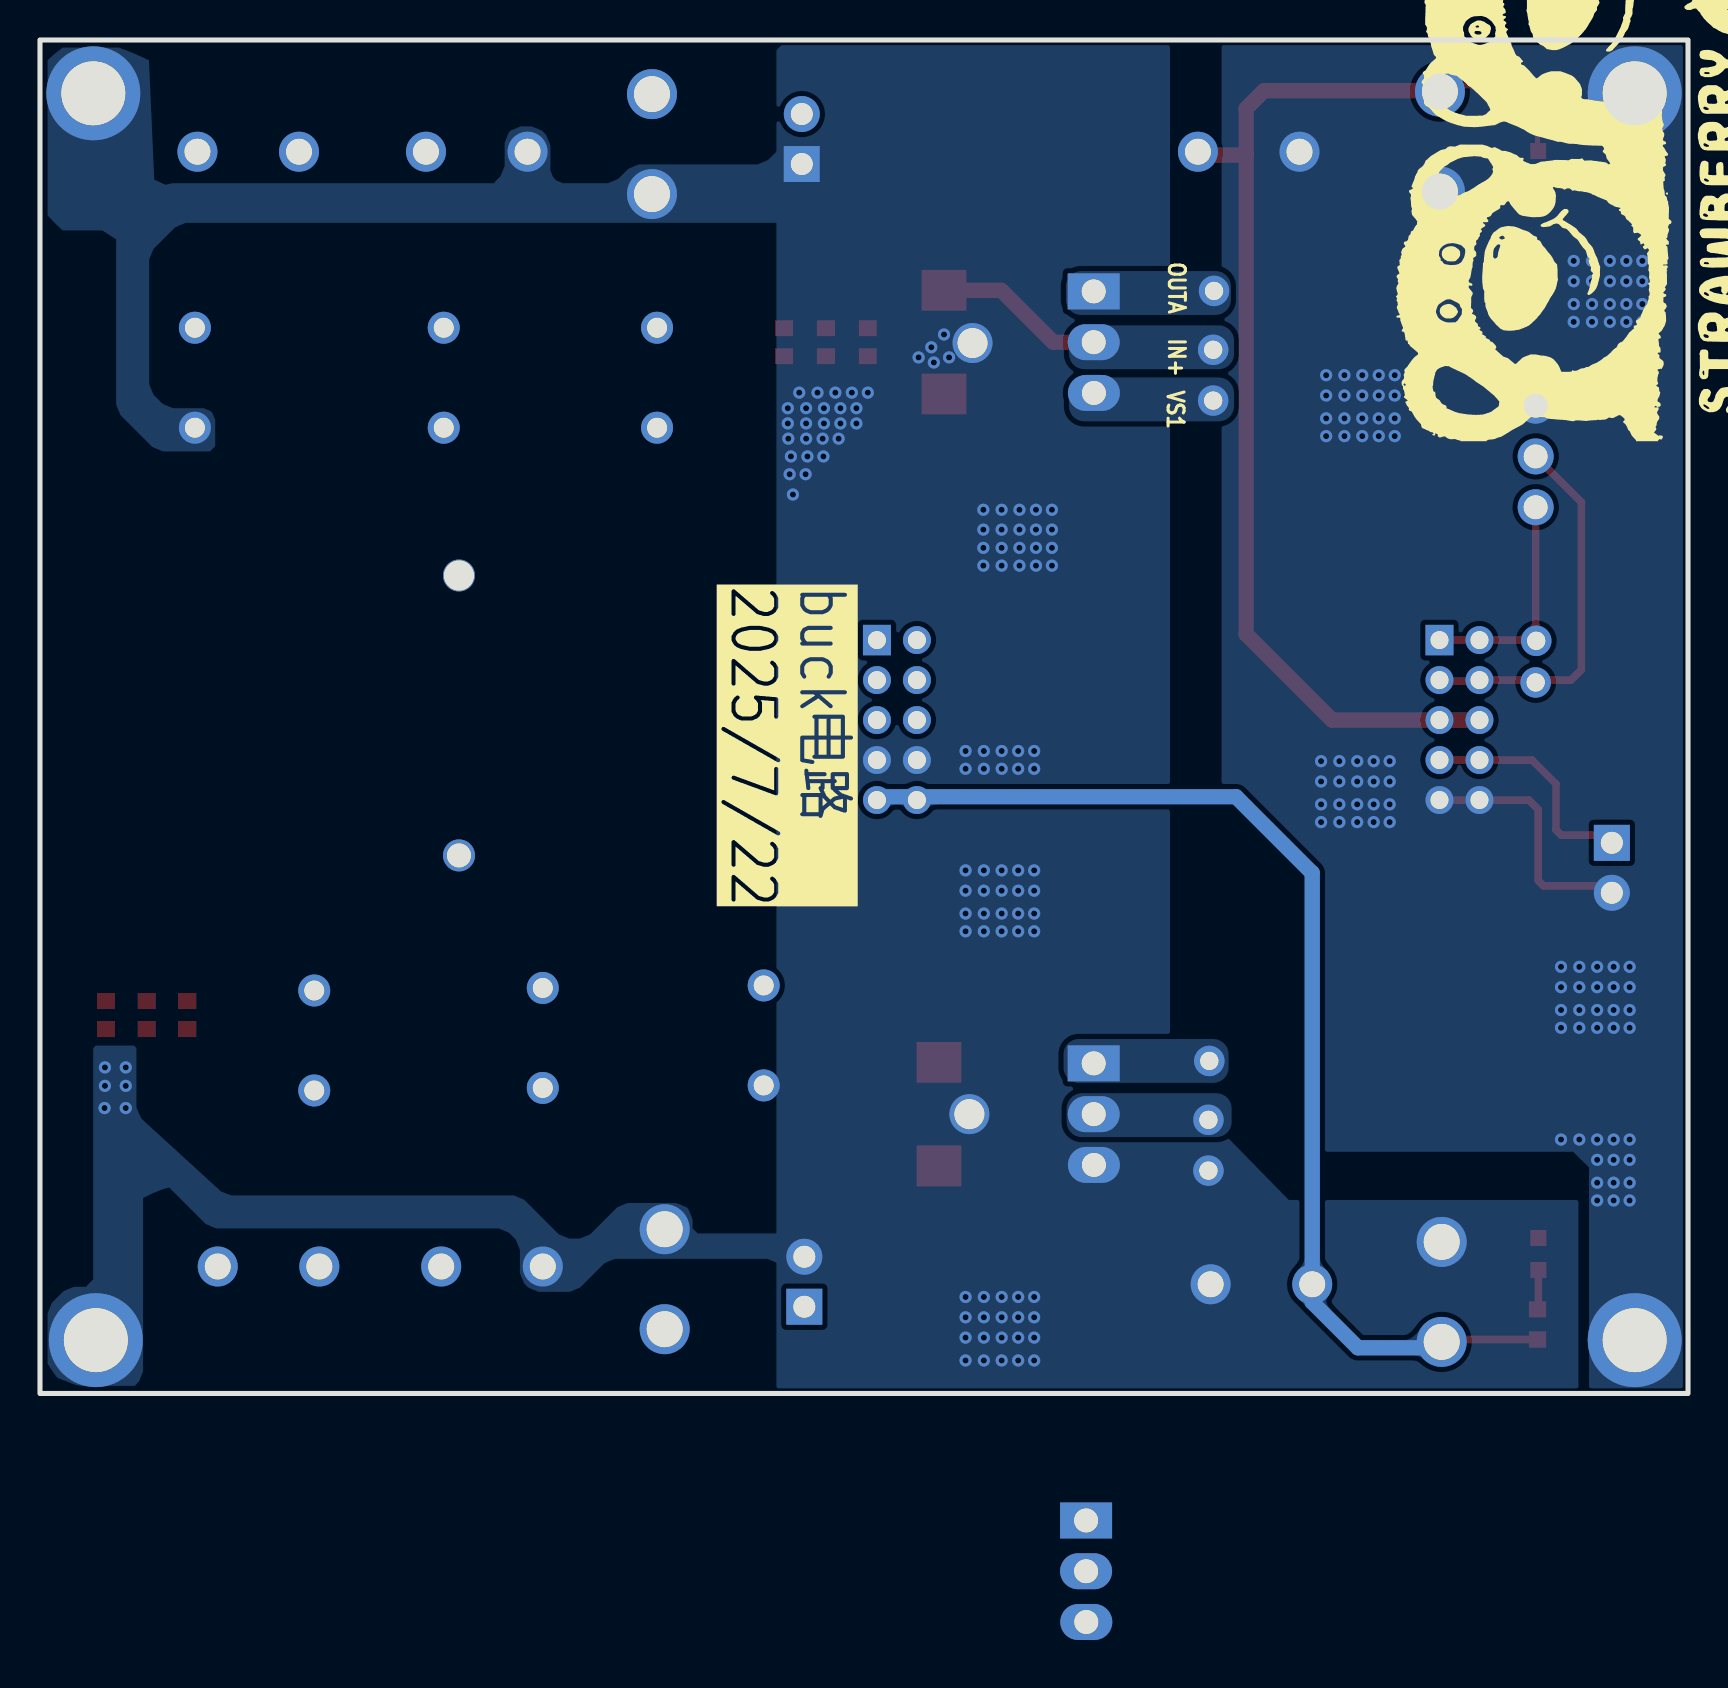
[diagram p3: board, bottom side, seen from below]

Outline 82.42 x 67.69 mm; copper layers: Top Layer, Bottom Layer. Coordinates in mm from the lower left corner of the outline.
Outline path: rectangle 0,67.69 82.42,0
Stack: Top Layer 0.035mm / Dielectric1 1.51mm FR4 er 4.5 / Bottom Layer 0.035mm

## Design rules (mm)
template: 自定义配置
spacing copperThickness1oz (default): track to track 0.102, other pairs 0.152 to 0.3
spacing copperThickness2oz: track to track 0.203, other pairs 0.152 to 0.3
track width copperThickness1oz (default): min 0.127, default 0.254, max 2.54
track width copperThickness2oz: min 0.203, default 0.254, max 2.54
differential pair differentialPair (default): width min 0.127, default 0.254, max 2.54; gap min 0.152, default 0.152
via viaSize (default): diameter min 0.5, default 0.61, max 10; hole min 0.3, default 0.305, max 6.3

## Placement (name value [footprint] x y rotation side)
C12  100nF  [C0603]  41.02 52.58 90 top
C13  1uF  [C0603]  45.21 52.58 90 top
C14  100nF  [C0603]  79.12 18.92 90 top
C15  1uF  [C0603]  75.06 18.92 90 top
C16  1uF  [C0603]  77.09 18.92 90 top
C17  1uF  [C0603]  43.12 52.58 90 top
C18  220uF  [CAP-TH_BD10.0-P5.00-D0.6-FD_2]  51.56 50.8 270 top
C19  220uF  [CAP-TH_BD10.0-P5.00-D0.6-FD_2]  74.68 50.8 270 top
C20  220uF  [CAP-TH_BD10.0-P5.00-D0.6-FD_2]  62.23 50.8 270 top
C21  220uF  [CAP-TH_BD10.0-P5.00-D0.6-FD_2]  46.23 17.91 270 top
C22  220uF  [CAP-TH_BD10.0-P5.00-D0.6-FD_2]  68.71 17.65 270 top
C23  220uF  [CAP-TH_BD10.0-P5.00-D0.6-FD_2]  57.28 17.78 270 top
CN2  XH-3AW  [CONN-TH_3P-P2.54_HCTL_XH-3AW]  7.62 46.86 90 top
CN4  XT30UPB-M  [CONN-TH_XT30UPB-M]  51.82 62.48 90 top
CN6  ZX-XH2.54-2PZZ  [CONN-TH_2P-P2.50_HX25003-2A]  44.2 5.59 90 top
CN7  ZX-XH2.54-2PZZ  [CONN-TH_2P-P2.50_HX25003-2A]  3.81 26.29 270 top
CN8  XT30UPB-M  [CONN-TH_XT30UPB-M]  51.18 5.72 270 top
CN9  ZX-XH2.54-2PZZ  [CONN-TH_2P-P2.50_HX25003-2A]  44.32 62.74 90 top
CN10  XT30UPB-M  [CONN-TH_XT30UPB-M]  12.32 5.08 270 top
CN11  XT30UPB-M  [CONN-TH_XT30UPB-M]  12.41 62.61 90 top
LED1  LTST-C190KSKT  [LED0603-RD]  7.49 61.34 90 top
LED2  LTST-C190KSKT  [LED0603-RD]  7.48 6.97 270 top
NOREF  -  [Pad_e765]  23.94 16.63 0 top
NOREF#2  -  [Pad_e766]  23.99 13.69 0 top
NOREF#3  -  [Pad_e758]  23.75 49.66 0 top
NOREF#4  -  [Pad_e55]  2.67 2.67 0 top
NOREF#5  -  [Pad_e56]  2.67 65.02 0 top
NOREF#6  -  [Pad_e52]  79.76 65.02 0 top
NOREF#7  -  [Pad_e54]  79.63 2.67 0 top
NOREF#8  -  [Pad_e757]  23.75 52.2 0 top
NOREF#9  -  [Pad_e767]  23.99 11.15 0 top
NOREF#10  -  [Pad_e756]  23.71 55.14 0 top
NOREF#11  -  [Pad_e740]  7.59 37.64 0 top
NOREF#12  -  [Pad_e735]  7.62 35.56 0 top
P1  WJ500V-5.08-2P  [CONN-TH_2P-P5.00_WJ500V-5.08-2P]  72.01 62.1 0 top
P2  WJ500V-5.08-2P  [CONN-TH_2P-P5.00_WJ500V-5.08-2P]  70.99 6.35 180 top
P3  WJ500V-5.08-2P  [CONN-TH_2P-P5.00_WJ500V-5.08-2P]  60.58 62.1 0 top
P4  WJ500V-5.08-2P  [CONN-TH_2P-P5.00_WJ500V-5.08-2P]  59.82 6.35 180 top
P9  WJ500V-5.08-2P  [CONN-TH_2P-P5.00_WJ500V-5.08-2P]  21.33 5.46 180 top
P10  WJ500V-5.08-2P  [CONN-TH_2P-P5.00_WJ500V-5.08-2P]  21.97 62.1 0 top
Q1  IRF540NPBF  [TO-220-3_L10.0-W4.5-P2.54-L]  29.72 52.58 270 top
Q2  IRF540NPBF  [TO-220-3_L10.0-W4.5-P2.54-L]  29.72 13.97 270 top
Q3  IRF540NPBF  [TO-220-3_L10.0-W4.5-P2.54-L]  30.1 -8.89 270 top
R1  5kΩ  [R0603]  7.53 64.64 90 top
R2  5kΩ  [R0603]  7.53 3.45 270 top
U1  -  [UCC21520模块]  26.67 33.53 270 top
U6  SS510B  [SMB_L4.6-W3.5-LS5.3-RD]  37.21 52.58 270 top
U7  SS510B  [SMB_L4.6-W3.5-LS5.3-RD]  37.47 13.97 270 top
U9  -  [L_P14MM]  61.47 33.91 270 top
U20  15.5*10.5*21  [SINK-TH_L15.0-W10.5-H21.0]  35.78 52.53 270 top
U21  15.5*10.5*21  [SINK-TH_L15.0-W10.5-H21.0]  35.94 13.97 270 top

## Footprints (pads in the part's own frame, mm; a bottom-side part is the same pattern mirrored in y, then rotated)
C0603
  rect 0.8x0.9 smd: 1(-0.7,0) 2(0.7,0)
CAP-TH_BD10.0-P5.00-D0.6-FD_2
  round 1.6 hole 1: 1(-2.5,0) 2(2.5,0)
CONN-TH_2P-P2.50_HX25003-2A
  rect 1.8x1.8 hole 1.1: 1(-1.25,0)
  round 1.8 hole 1.1: 2(1.25,0)
CONN-TH_2P-P5.00_WJ500V-5.08-2P
  round 2 hole 1.3: 1(-2.54,0) 2(2.54,0)
CONN-TH_3P-P2.54_HCTL_XH-3AW
  round 1.8 hole 1.199: 1(-2.54,0) 2(0.002,0) 3(2.54,0)
CONN-TH_XT30UPB-M
  round 2.5 hole 1.8: 1(-2.5,0) 2(2.5,0)
L_P14MM
  round 1.6 hole 1.5x1.2: 1(-7,0)
  round 1.6 hole 1.2: 2(7,0)
LED0603-RD
  rect 0.8x0.8 smd: 1(-0.799,0) 2(0.799,0)
Pad_e52
  round 4.7 hole 3.2: 1(0,0)
Pad_e54
  round 4.7 hole 3.2: 1(0,0)
Pad_e55
  round 4.7 hole 3.2: 1(0,0)
Pad_e56
  round 4.7 hole 3.2: 1(0,0)
Pad_e735
  round 1.524 hole 0.914: 2(0,0)
Pad_e740
  round 1.524 hole 0.914: 2(0,0)
Pad_e756
  round 1.524 hole 0.914: 1(0,0)
Pad_e757
  round 1.524 hole 0.914: 1(0,0)
Pad_e758
  round 1.524 hole 0.914: 1(0,0)
Pad_e765
  round 1.524 hole 0.914: 1(0,0)
Pad_e766
  round 1.524 hole 0.914: 1(0,0)
Pad_e767
  round 1.524 hole 0.914: 1(0,0)
R0603
  rect 0.806x0.864 smd: 1(-0.753,0) 2(0.753,0)
SINK-TH_L15.0-W10.5-H21.0
  round 2 hole 1.5: 1(0,0)
SMB_L4.6-W3.5-LS5.3-RD
  rect 2.047x2.241 smd: 1(-2.591,0) 2(2.591,0)
TO-220-3_L10.0-W4.5-P2.54-L
  rect 1.8x2.6 hole 1.2: 1(-2.54,0.005)
  oval 1.8x2.6 hole 1.2: 2(0,0.005) 3(2.54,-0.005)
UCC21520模块
  rect 1.524x1.4 hole 0.9: 1(-4.151,-14.24) 6(-4.151,13.895)
  round 1.4 hole 0.9: 1(-4.151,-16.24) 2(-2.151,-14.24) 2(-2.151,-16.24) 3(-0.151,-14.24) 3(-0.151,-16.24) 4(1.849,-14.24) 4(1.849,-16.24) 5(3.849,-14.24) 5(3.849,-16.24) 6(-4.151,11.895) 7(-2.151,13.895) 7(-2.151,11.895) 8(-0.151,13.895) 8(-0.151,11.895) 9(1.849,13.895) 9(1.849,11.895) 10(3.849,13.895) 10(3.849,11.895)

## Nets
+5V: CN11.2 P10.2 R1.2 U1.3
+12V: CN10.2 P9.2 R2.2 U1.10
AGND: CN2.3 CN7.2 CN11.1 LED1.1 NOREF#4.1 NOREF#5.1 P10.1 U1.5
PGND: C12.1 C13.1 C14.1 C15.1 C16.1 C17.1 C18.2 C19.2 C20.2 C21.2 C22.2 C23.2 CN4.1 CN6.2 CN8.1 CN9.1 CN10.1 LED2.1 NOREF#6.1 NOREF#7.1 NOREF#9.1 P3.1 P4.2 P9.1 Q2.3 U1.9 U7.2 U20.1 U21.1
DIS: CN7.1 U1.4
IN+: CN4.2 CN9.2 P1.1 P3.2
OUT+: CN6.1 CN8.2 P2.2 P4.1
OUTA: NOREF#10.1 Q1.1 U1.6
OUTB: NOREF.1 Q2.1 U1.8
PWMA: CN2.1 NOREF#11.2 U1.1
PWMB: CN2.2 NOREF#12.2 U1.2
VS: NOREF#2.1 NOREF#3.1 Q1.3 Q2.2 U1.7 U6.2 U7.1 U9.1
$1N2703: LED1.2 R1.1
$1N2751: LED2.2 R2.1
$1N2815: C12.2 C13.2 C17.2 C18.1 C19.1 C20.1 NOREF#8.1 P1.2 Q1.2 U6.1
$1N2826: C14.2 C15.2 C16.2 C21.1 C22.1 C23.1 P2.1 U9.2

Pads without a net: Q3 1 2 3

## Via types
v1: diameter 0.61, hole 0.305, Top Layer to Bottom Layer, 200 vias

## Routing (per net, layer and track width the routed paths; a pad name or vN(x,y) marks a point on that pad's centre or on a via; arc(x,y) is an arc through that point)
+5V: length 57.3
  Top Layer w0.254: CN11.2 12.12,65.4 R1.2
  Top Layer w0.762: CN11.2 12.45,65.15 21.21,65.15 22.1,64.26 22.1,61.93 ; P10.2 24.34,61.93 22.1,61.93 ; 22.1,61.93 22.1,37.97 17.8,33.68 10.43,33.68
+12V: length 57.3
  Top Layer w0.381: CN10.2 12.2,2.7 R2.2
  Bottom Layer w0.762: CN10.2 12.61,2.29 16.51,2.29 18.79,4.57 P9.2 18.79,26.03 22.61,29.84 40.4,29.84 U1.10
AGND: length 12.6
  Top Layer w0.381: CN7.2 4.16,25.38 7.22,25.38 7.49,25.65 7.49,29.21 7.96,29.68 12.43,29.68
  vias: v1(2.29,56.64) v1(2.29,55.63) v1(2.29,54.48) v1(2.29,53.59) v1(2.92,21.34) v1(2.92,20.32) v1(2.92,19.18) v1(2.92,18.29) v1(2.92,12.7) v1(2.92,11.68) v1(2.92,10.54) v1(2.92,9.65) v1(3.09,56.64) v1(3.09,55.63) v1(3.09,54.48) v1(3.09,53.59) v1(3.72,21.34) v1(3.72,20.32) v1(3.72,19.18) v1(3.72,18.29) v1(3.72,12.7) v1(3.72,11.68) v1(3.72,10.54) v1(3.72,9.65) v1(3.91,56.64) v1(3.91,55.63) v1(3.91,54.48) v1(3.91,53.59) v1(4.55,21.34) v1(4.55,20.32) v1(4.55,19.18) v1(4.55,18.29) v1(4.55,12.7) v1(4.55,11.68) v1(4.55,10.54) v1(4.55,9.65) v1(4.8,56.64) v1(4.8,55.63) v1(4.8,54.48) v1(4.8,53.59) v1(5.44,21.34) v1(5.44,20.32) v1(5.44,19.18) v1(5.44,18.29) v1(5.44,12.7) v1(5.72,56.64) v1(5.72,55.63) v1(5.72,54.48) v1(5.72,53.59) v1(6.35,21.34) v1(6.35,20.32) v1(6.35,19.18) v1(6.35,18.29) v1(6.35,12.7) v1(14.67,50.93) v1(14.67,49.91) v1(14.67,48.77) v1(14.67,47.88) v1(14.92,31.62) v1(14.92,30.61) v1(14.92,29.46) v1(14.92,28.58) v1(15.47,50.93) v1(15.47,49.91) v1(15.47,48.77) v1(15.47,47.88) v1(15.72,31.62) v1(15.72,30.61) v1(15.72,29.46) v1(15.72,28.58) v1(16.29,50.93) v1(16.29,49.91) v1(16.29,48.77) v1(16.29,47.88) v1(16.55,31.62) v1(16.55,30.61) v1(16.55,29.46) v1(16.55,28.58) v1(17.18,50.93) v1(17.18,49.91) v1(17.18,48.77) v1(17.18,47.88) v1(17.44,31.62) v1(17.44,30.61) v1(17.44,29.46) v1(17.44,28.58) v1(18.1,50.93) v1(18.1,49.91) v1(18.1,48.77) v1(18.1,47.88) v1(18.35,31.62) v1(18.35,30.61) v1(18.35,29.46) v1(18.35,28.58)
PGND:
  vias: v1(31.81,44.2) v1(31.81,43.2) v1(31.81,42.29) v1(31.81,41.4) v1(32.61,44.2) v1(32.61,43.2) v1(32.61,42.29) v1(32.61,41.4) v1(32.7,32.13) v1(32.7,31.24) v1(32.7,26.16) v1(32.7,25.15) v1(32.7,24) v1(32.7,23.11) v1(32.7,4.83) v1(32.7,3.81) v1(32.7,2.79) v1(32.7,1.65) v1(33.44,44.2) v1(33.44,43.2) v1(33.44,42.29) v1(33.44,41.4) v1(33.5,32.13) v1(33.5,31.24) v1(33.5,26.16) v1(33.5,25.15) v1(33.5,24) v1(33.5,23.11) v1(33.5,4.83) v1(33.5,3.81) v1(33.5,2.79) v1(33.5,1.65) v1(34.33,44.2) v1(34.33,43.2) v1(34.33,42.29) v1(34.33,41.4) v1(34.33,32.13) v1(34.33,31.24) v1(34.33,26.16) v1(34.33,25.15) v1(34.33,24) v1(34.33,23.11) v1(34.33,4.83) v1(34.33,3.81) v1(34.33,2.79) v1(34.33,1.65) v1(35.24,44.2) v1(35.24,43.2) v1(35.24,42.29) v1(35.24,41.4) v1(35.22,32.13) v1(35.22,31.24) v1(35.22,26.16) v1(35.22,25.15) v1(35.22,24) v1(35.22,23.11) v1(35.22,4.83) v1(35.22,3.81) v1(35.22,2.79) v1(35.22,1.65) v1(36.13,32.13) v1(36.13,31.24) v1(36.13,26.16) v1(36.13,25.15) v1(36.13,24) v1(36.13,23.11) v1(36.13,4.83) v1(36.13,3.81) v1(36.13,2.79) v1(36.13,1.65) v1(36.96,51.82) v1(37.21,52.96) v1(37.72,51.56) v1(37.85,52.32) v1(38.48,51.82) v1(41.02,50.05) v1(41.59,49.28) v1(41.59,48.51) v1(41.82,50.05) v1(42.39,49.28) v1(42.39,48.51) v1(42.48,47.75) v1(42.65,50.05) v1(43.22,49.28) v1(43.22,48.51) v1(43.24,46.86) v1(43.28,47.75) v1(43.54,50.05) v1(44.04,46.86) v1(44.11,49.28) v1(44.11,48.51) v1(44.1,47.75) v1(44.13,45.97) v1(44.45,50.05) v1(44.77,44.96) v1(44.87,46.86) v1(44.93,45.97) v1(45.02,49.28) v1(45.02,48.51) v1(45,47.75) v1(78.13,16.31) v1(78.13,15.38) v1(78.13,14.27) v1(79.18,16.31) v1(79.18,15.38) v1(79.19,14.27)
DIS: length 11.7
  Top Layer w0.381: CN7.1 4.2,27.92 6.33,27.92 6.6,28.19 6.6,30.48 7.8,31.68 12.43,31.68
PWMA: length 11
  Top Layer w0.381: 12.43,37.68 8.34,37.68 7.62,38.39 CN2.1
PWMB: length 18.9
  Top Layer w0.381: 10.43,35.68 5.85,35.68 5.33,36.2 5.33,44.58 CN2.2 ; 10.43,35.62 12.37,35.62 12.43,35.68
$1N2703: length 1.8
  Top Layer w0.254: LED1.2 7.53,62.17 R1.1
$1N2751: length 2
  Top Layer w0.381: LED2.2 7.48,4.25 7.53,4.21
$1N2815: length 8.6
  Top Layer w0.762: U6.1 34.34,55.17 31.75,52.58 Q1.2

## Copper pours and planes (outline as drawn; the poured copper is in the pictures)
+5V on Top Layer: 9.54,34.43 13.11,34.43 13.11,32.81 9.54,32.81
AGND on Top Layer: 22.82,18 16.92,12.09 5.74,12.09 4.95,11.3 4.95,-1.52 4.57,-1.91 -1.52,-1.91 -1.78,-1.65 -1.78,70.74 -1.91,70.87 22.82,70.87
AGND on Top Layer: 9.52,30.48 13.09,30.48 13.09,28.86 9.52,28.86
AGND on Bottom Layer: 23.33,16.48 18.95,12.09 5.74,12.09 4.95,11.3 4.95,-1.52 4.57,-1.91 -1.52,-1.91 -1.78,-1.65 -1.78,70.74 -1.91,70.87 23.33,70.87
PGND on Top Layer: 28.19,15.11 38.48,15.11 38.48,10.29 28.19,10.29
PGND on Top Layer: 26.03,67.95 26.03,16.12 20.09,10.05 5.61,10.05 5.61,-2.16 45.72,-2.16 45.72,67.56 45.34,67.95
PGND on Top Layer: 34.42,53.72 75.56,53.72 75.56,46.99 34.42,46.99
PGND on Top Layer: 34.8,18.64 79.76,18.64 79.76,10.29 34.8,10.29
PGND on Bottom Layer: 22.82,12.41 31.08,12.41 31.08,10.21 22.82,10.21
PGND on Bottom Layer: 25.91,67.56 25.91,15.74 19.96,9.67 5.48,9.67 5.48,-2.54 45.59,-2.54 45.59,67.18 45.21,67.56
PGND on Bottom Layer: 42.93,17.4 82.04,17.4 82.04,0.38 42.93,0.38
PGND on Bottom Layer: 42.93,67.31 82.04,67.31 82.04,47.12 42.93,47.12
DIS on Top Layer: 9.62,32.49 13.19,32.49 13.19,30.87 9.62,30.87
IN+ on Top Layer: 42.94,66.24 70.87,66.24 70.87,60.96 42.94,60.96
OUT+ on Top Layer: 43.18,7.49 69.6,7.49 69.6,1.91 43.18,1.91
OUTA on Top Layer: 25.02,56.13 41.53,56.13 41.53,36.82 25.02,36.82
OUTA on Bottom Layer: 22.86,56.13 31.12,56.13 31.12,53.94 22.86,53.94
OUTB on Top Layer: 28.49,34.54 41.4,34.54 41.4,15.49 28.49,15.49
OUTB on Bottom Layer: 22.98,17.73 31.23,17.73 31.23,15.53 22.98,15.53
PWMA on Top Layer: 6.83,38.5 13.19,38.5 13.19,36.88 6.83,36.88
PWMB on Top Layer: 6.79,36.44 13.15,36.44 13.15,34.82 6.79,34.82
VS on Top Layer: 28.01,50.93 62.99,50.93 62.99,15.49 28.01,15.49
VS on Top Layer: 28.32,17.65 36.93,17.65 36.93,13.08 28.32,13.08
VS on Bottom Layer: 22.71,50.81 30.96,50.81 30.96,48.62 22.71,48.62
VS on Bottom Layer: 22.82,15.02 31.08,15.02 31.08,12.82 22.82,12.82
$1N2815 on Top Layer: 28.01,56.28 38.35,56.28 38.35,51.56 28.01,51.56
$1N2815 on Top Layer: 36.1,63.5 75.95,63.5 75.95,52.58 36.1,52.58
$1N2815 on Bottom Layer: 22.71,53.42 30.96,53.42 30.96,51.23 22.71,51.23
$1N2826 on Top Layer: 80.14,20.95 81.66,20.95 81.66,5.46 80.14,5.46
$1N2826 on Top Layer: 72.39,7.11 81.69,7.11 81.69,5.46 72.39,5.46
$1N2826 on Top Layer: 45.34,28.03 81.54,28.03 81.54,19.18 45.34,19.18

Small or netless copper shapes (teardrops, artwork), in the pictures only: 35 on Top Layer, 6 on Bottom Layer

## Text on the board
Bottom Silkscreen Layer: OUTA | IN+ | VS1 | buck电路 / 2025/7/22
Top Silkscreen Layer: PGND | OUT+ | CHA | CHB | AGND | OUT- | IN+ | IN- | +5V | DIS | +12V | OUTA | VS1 | OUTB | VS | 电流采样
